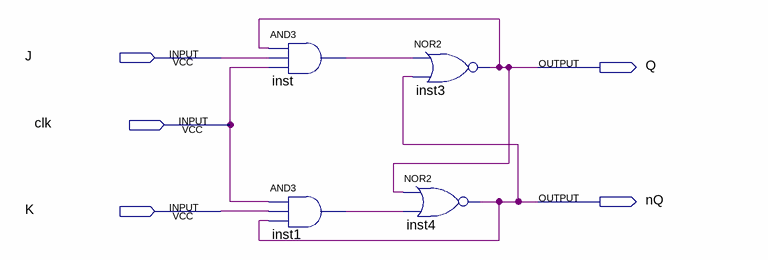
[diagram p0: schematic sheet]
// Quartus schematic flipflop_jk2.bdf as structural Verilog: 4 symbols, 5 pins
module flipflop_jk2 (
  input  J,
  input  clk,
  input  K,
  output Q,
  output nQ
);

  wire inst1_out, inst_out;

  and inst (inst_out, Q, J, clk);
  and inst1 (inst1_out, clk, K, nQ);
  nor inst3 (Q, inst_out, nQ);
  nor inst4 (nQ, Q, inst1_out);
endmodule
